# Altium project GNSS_Workshop.PrjPcb
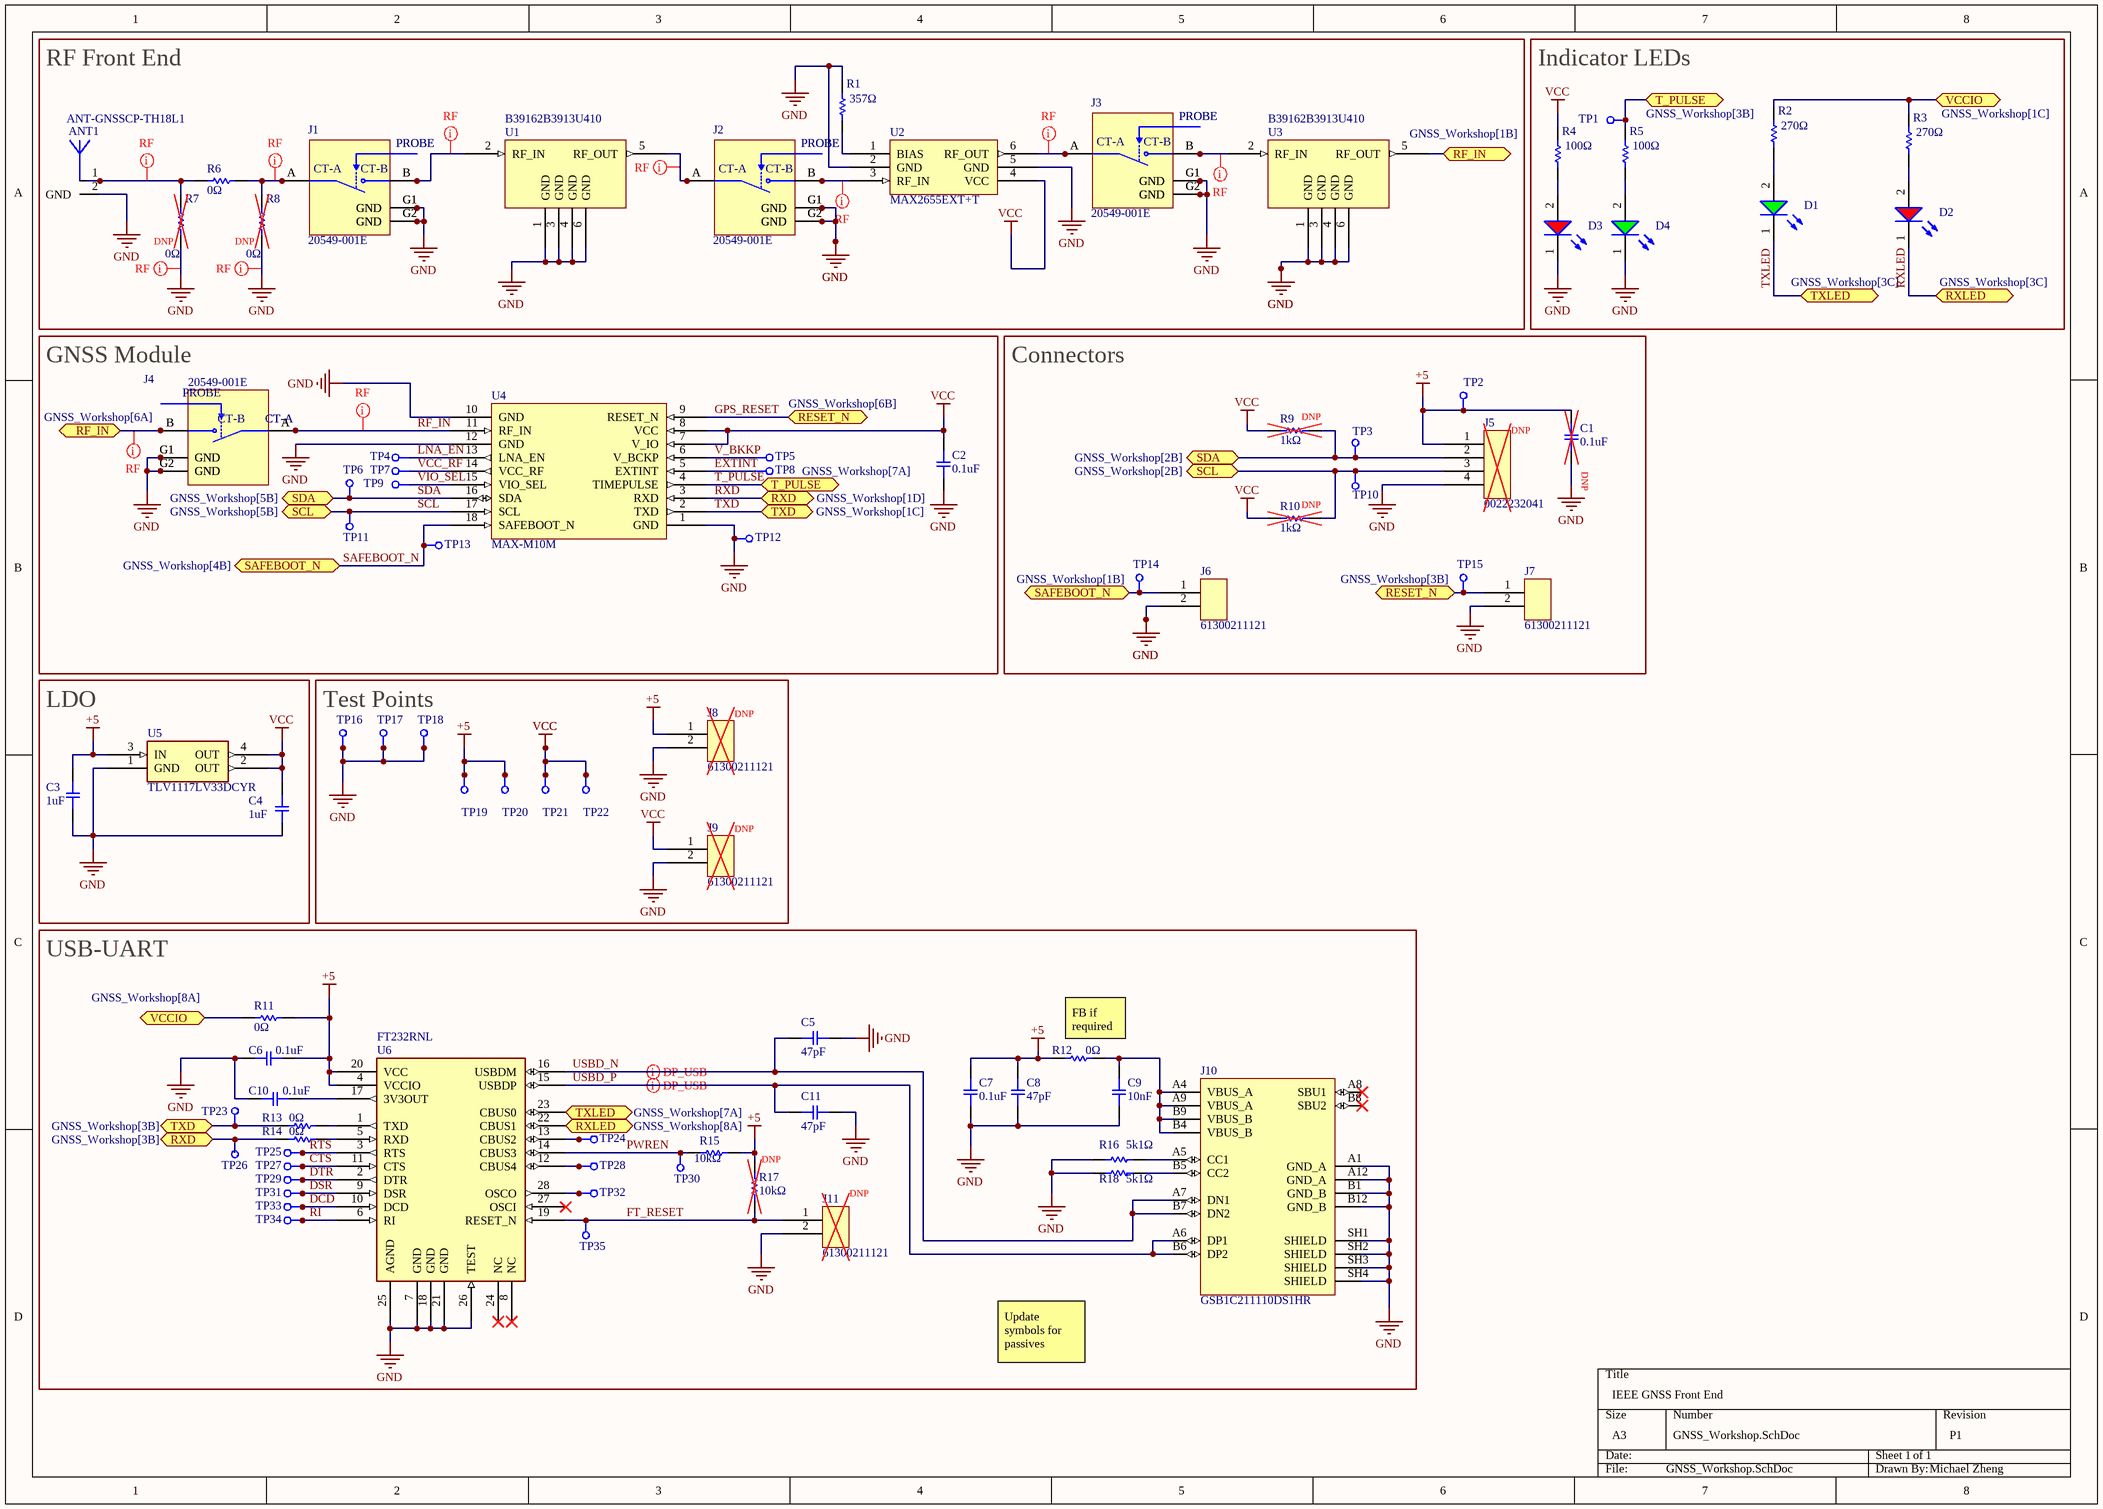
[diagram p0: GNSS_Workshop.SchDoc]
Author: Michael Zheng; Revision: P1; Title: IEEE GNSS Front End
1 sheet, 86 parts. Net scope: flat (ports and power ports of the same name join across sheets).

## Sheet GNSS_Workshop.SchDoc: IEEE GNSS Front End
size A3; SheetNumber: 1; SheetTotal: 1

### Parts
ANT1  ANT-GNSSCP-TH18L1  [ANT-GNSSCP-TH18L1]
C1  Capacitance: 0.1uF  [CAP_MURATA_0603]  (hidden comment: GCM188L81H104KA57D)
C2  Capacitance: 0.1uF  [CAP_MURATA_0603]  (hidden comment: GCM188L81H104KA57D)
C3  Capacitance: 1uF  [CAP_MURATA_0603]  (hidden comment: GRM188R61A105KA61D)
C4  Capacitance: 1uF  [CAP_MURATA_0603]  (hidden comment: GRM188R61A105KA61D)
C5  Capacitance: 47pF  [CAP_MURATA_0603]  (hidden comment: GCM188L81H104KA57D)
C6  Capacitance: 0.1uF  [CAP_MURATA_0603]  (hidden comment: GCM188L81H104KA57D)
C7  Capacitance: 0.1uF  [CAP_MURATA_0603]  (hidden comment: GCM188L81H104KA57D)
C8  Capacitance: 47pF  [CAP_MURATA_0603]  (hidden comment: GCM188L81H104KA57D)
C9  Capacitance: 10nF  [CAP_MURATA_0603]  (hidden comment: GCM188L81H104KA57D)
C10  Capacitance: 0.1uF  [CAP_MURATA_0603]  (hidden comment: GCM188L81H104KA57D)
C11  Capacitance: 47pF  [CAP_MURATA_0603]  (hidden comment: GCM188L81H104KA57D)
D1  Green, 3.2V, 140°  [WL-SMCW - duplicate]  (value not drawn)
D2  Red, 2V, 140°  [WL-SMCW - duplicate]  (value not drawn)
D3  Red, 2V, 140°  [WL-SMCW - duplicate]  (value not drawn)
D4  Green, 3.2V, 140°  [WL-SMCW - duplicate]  (value not drawn)
J1  20549-001E  [IPEX_20549-001E]
J2  20549-001E  [IPEX_20549-001E]
J3  20549-001E  [IPEX_20549-001E]
J4  20549-001E  [IPEX_20549-001E]
J5  0022232041  [CONN HEADER VERT 4POS 2.54MM]
J6  61300211121  [61300211121]
J7  61300211121  [61300211121]
J8  61300211121  [61300211121]
J9  61300211121  [61300211121]
J10  GSB1C211110DS1HR  [AMPHENOL_GSB1C211110DS1HR]
J11  61300211121  [61300211121]
R1  Resistance: 357Ω  [RC0603JR-070RL]  (hidden comment: RC0603JR-070RL)
R2  Resistance: 270Ω  [RC0603JR-070RL]  (hidden comment: RC0603JR-070RL)
R3  Resistance: 270Ω  [RC0603JR-070RL]  (hidden comment: RC0603JR-070RL)
R4  Resistance: 100Ω  [RC0603JR-070RL]  (hidden comment: RC0603JR-070RL)
R5  Resistance: 100Ω  [RC0603JR-070RL]  (hidden comment: RC0603JR-070RL)
R6  Resistance: 0Ω  [RC0603JR-070RL]  (hidden comment: RC0603JR-070RL)
R7  Resistance: 0Ω  [RC0603JR-070RL]  (hidden comment: RC0603JR-070RL)
R8  Resistance: 0Ω  [RC0603JR-070RL]  (hidden comment: RC0603JR-070RL)
R9  Resistance: 1kΩ  [RC0603JR-070RL]  (hidden comment: RC0603JR-070RL)
R10  Resistance: 1kΩ  [RC0603JR-070RL]  (hidden comment: RC0603JR-070RL)
R11  Resistance: 0Ω  [RC0603JR-070RL]  (hidden comment: RC0603JR-070RL)
R12  Resistance: 0Ω  [RC0603JR-070RL]  (hidden comment: RC0603JR-070RL)
R13  Resistance: 0Ω  [RC0603JR-070RL]  (hidden comment: RC0603JR-070RL)
R14  Resistance: 0Ω  [RC0603JR-070RL]  (hidden comment: RC0603JR-070RL)
R15  Resistance: 10kΩ  [RC0603JR-070RL]  (hidden comment: RC0603JR-070RL)
R16  Resistance: 5k1Ω  [RC0603JR-070RL]  (hidden comment: RC0603JR-070RL)
R17  Resistance: 10kΩ  [RC0603JR-070RL]  (hidden comment: RC0603JR-070RL)
R18  Resistance: 5k1Ω  [RC0603JR-070RL]  (hidden comment: RC0603JR-070RL)
TP1  TEST_POINT  [TEST_POINT]  (value not drawn)
TP2  TEST_POINT  [TEST_POINT]  (value not drawn)
TP3  TEST_POINT  [TEST_POINT]  (value not drawn)
TP4  TEST_POINT  [TEST_POINT]  (value not drawn)
TP5  TEST_POINT  [TEST_POINT]  (value not drawn)
TP6  TEST_POINT  [TEST_POINT]  (value not drawn)
TP7  TEST_POINT  [TEST_POINT]  (value not drawn)
TP8  TEST_POINT  [TEST_POINT]  (value not drawn)
TP9  TEST_POINT  [TEST_POINT]  (value not drawn)
TP10  TEST_POINT  [TEST_POINT]  (value not drawn)
TP11  TEST_POINT  [TEST_POINT]  (value not drawn)
TP12  TEST_POINT  [TEST_POINT]  (value not drawn)
TP13  TEST_POINT  [TEST_POINT]  (value not drawn)
TP14  TEST_POINT  [TEST_POINT]  (value not drawn)
TP15  TEST_POINT  [TEST_POINT]  (value not drawn)
TP16  TEST_POINT  [TEST_POINT]  (value not drawn)
TP17  TEST_POINT  [TEST_POINT]  (value not drawn)
TP18  TEST_POINT  [TEST_POINT]  (value not drawn)
TP19  TEST_POINT  [TEST_POINT]  (value not drawn)
TP20  TEST_POINT  [TEST_POINT]  (value not drawn)
TP21  TEST_POINT  [TEST_POINT]  (value not drawn)
TP22  TEST_POINT  [TEST_POINT]  (value not drawn)
TP23  TEST_POINT  [TEST_POINT]  (value not drawn)
TP24  TEST_POINT  [TEST_POINT]  (value not drawn)
TP25  TEST_POINT  [TEST_POINT]  (value not drawn)
TP26  TEST_POINT  [TEST_POINT]  (value not drawn)
TP27  TEST_POINT  [TEST_POINT]  (value not drawn)
TP28  TEST_POINT  [TEST_POINT]  (value not drawn)
TP29  TEST_POINT  [TEST_POINT]  (value not drawn)
TP30  TEST_POINT  [TEST_POINT]  (value not drawn)
TP31  TEST_POINT  [TEST_POINT]  (value not drawn)
TP32  TEST_POINT  [TEST_POINT]  (value not drawn)
TP33  TEST_POINT  [TEST_POINT]  (value not drawn)
TP34  TEST_POINT  [TEST_POINT]  (value not drawn)
TP35  TEST_POINT  [TEST_POINT]  (value not drawn)
U1  B39162B3913U410  [B39162B3913U410]
U2  MAX2655EXT+T  [MAX2655EXT+T]
U3  B39162B3913U410  [B39162B3913U410]
U4  MAX-M10M  [MAX-M10M]
U5  TLV1117LV33DCYR  [TLV1117LV33DCYR]
U6  FT232RNL  [FT232RNL]

### Blocks framed on the sheet
RF Front End: ANT1 J1-J3 R1 R6-R8 U1-U3
Indicator LEDs: D1-D4 R2-R5 TP1
GNSS Module: C2 J4 TP4-TP9 TP11-TP13 U4
Connectors: C1 J5-J7 R9 R10 TP2 TP3 TP10 TP14 TP15
LDO: C3 C4 U5
Test Points: J8 J9 TP16-TP22
USB-UART: C5-C11 J10 J11 R11-R18 TP23-TP35 U6

### Ports
RESET_N (bidir, see GNSS_Workshop[3B]), RESET_N (bidir, see GNSS_Workshop[6B]), RF_IN (bidir, see GNSS_Workshop[1B]), RF_IN (bidir, see GNSS_Workshop[6A]), RXD (bidir, see GNSS_Workshop[1D]), RXD (bidir, see GNSS_Workshop[3B]), RXLED (bidir, see GNSS_Workshop[3C]), RXLED (bidir, see GNSS_Workshop[8A]), SAFEBOOT_N (bidir, see GNSS_Workshop[1B]), SAFEBOOT_N (bidir, see GNSS_Workshop[4B]), SCL (bidir, see GNSS_Workshop[2B]), SCL (bidir, see GNSS_Workshop[5B]), SDA (bidir, see GNSS_Workshop[2B]), SDA (bidir, see GNSS_Workshop[5B]), T_PULSE (bidir, see GNSS_Workshop[3B]), T_PULSE (bidir, see GNSS_Workshop[7A]), TXD (bidir, see GNSS_Workshop[1C]), TXD (bidir, see GNSS_Workshop[3B]), TXLED (bidir, see GNSS_Workshop[3C]), TXLED (bidir, see GNSS_Workshop[7A]), VCCIO (bidir, see GNSS_Workshop[1C]), VCCIO (bidir, see GNSS_Workshop[8A])

### Nets
+5: C1.1 C3.2 C6.2 C7.1 C8.1 J5.1 J8.1 R11.1 R12.1 R15.2 R17.2 TP2.1 TP19.1 TP20.1 U5.3(IN) U6.4(VCCIO) U6.20(VCC)
GND: ANT1.2(GND) C1.2 C2.1 C3.1 C4.1 C5.2 C6.1 C7.2 C8.2 C9.2 C10.2 C11.2 D3.1(K) D4.1(K) J1.G1(GND) J1.G2(GND) J2.G1(GND) J2.G2(GND) J3.G1(GND) J3.G2(GND) J4.G1(GND) J4.G2(GND) J5.4 J6.2 J7.2 J8.2 J9.2 J10.A1(GND_A) J10.A12(GND_A) J10.B1(GND_B) J10.B12(GND_B) J10.SH1(SHIELD) J10.SH2(SHIELD) J10.SH3(SHIELD) J10.SH4(SHIELD) J11.2 R1.2 R7.1 R8.1 R16.1 R18.1 TP12.1 TP16.1 TP17.1 TP18.1 U1.1(GND) U1.3(GND) U1.4(GND) U1.6(GND) U2.2(GND) U2.5(GND) U3.1(GND) U3.3(GND) U3.4(GND) U3.6(GND) U4.1(GND) U4.10(GND) U4.12(GND) U5.1(GND) U6.7(GND) U6.18(GND) U6.21(GND) U6.25(AGND) U6.26(TEST)
VCC: C2.2 C4.2 J9.1 R4.2 R9.2 R10.2 TP21.1 TP22.1 U2.4(VCC) U4.7(V_IO) U4.8(VCC) U5.2(OUT) U5.4(OUT)
CTS: TP27.1 U6.11(CTS)
DCD: TP33.1 U6.10(DCD)
DSR: TP31.1 U6.9(DSR)
DTR: TP29.1 U6.2(DTR)
EXTINT: TP8.1 U4.5(EXTINT)
FT_RESET: J11.1 R17.1 TP35.1 U6.19(RESET_N)
GPS_RESET: J7.1 TP15.1 U4.9(RESET_N) ; port RESET_N
LNA_EN: TP4.1 U4.13(LNA_EN)
PWREN: R15.1 TP30.1 U6.14(CBUS3)
RF_IN: J4.A(CT-A) U4.11(RF_IN)
RI: TP34.1 U6.6(RI)
RTS: TP25.1 U6.3(RTS)
RXD: R14.1 TP26.1 U4.3(RXD) ; port RXD
RXLED: D2.1(K) U6.22(CBUS1) ; port RXLED
SAFEBOOT_N: J6.1 TP13.1 TP14.1 U4.18(SAFEBOOT_N) ; port SAFEBOOT_N
SCL: J5.3 R10.1 TP10.1 TP11.1 U4.17(SCL) ; port SCL
SDA: J5.2 R9.1 TP3.1 TP6.1 U4.16(SDA) ; port SDA
T_PULSE: R5.2 TP1.1 U4.4(TIMEPULSE) ; port T_PULSE
TXD: R13.1 TP23.1 U4.2(TXD) ; port TXD
TXLED: D1.1(K) U6.23(CBUS0) ; port TXLED
USBD_N: C5.1 J10.A7(DN1) J10.B7(DN2) U6.16(USBDM)
USBD_P: C11.1 J10.A6(DP1) J10.B6(DP2) U6.15(USBDP)
V_BKKP: TP5.1 U4.6(V_BCKP)
VCC_RF: TP7.1 U4.14(VCC_RF)
VIO_SEL: TP9.1 U4.15(VIO_SEL)
NetANT1_1: ANT1.1(RF_IN) R6.2 R7.2
NetC9_1: C9.1 J10.A4(VBUS_A) J10.A9(VBUS_A) J10.B4(VBUS_B) J10.B9(VBUS_B) R12.2
NetC10_1: C10.1 U6.17(3V3OUT)
NetD1_2: D1.2(A) R2.1
NetD2_2: D2.2(A) R3.1
NetD3_2: D3.2(A) R4.1
NetD4_2: D4.2(A) R5.1
NetJ1_A: J1.A(CT-A) R6.1 R8.2
NetJ1_B: J1.B(CT-B) U1.2(RF_IN)
NetJ2_A: J2.A(CT-A) U1.5(RF_OUT)
NetJ2_B: J2.B(CT-B) U2.3(RF_IN)
NetJ3_A: J3.A(CT-A) U2.6(RF_OUT)
NetJ3_B: J3.B(CT-B) U3.2(RF_IN)
NetJ4_B: J4.B(CT-B) U3.5(RF_OUT) ; port RF_IN
NetJ10_A5: J10.A5(CC1) R16.2
NetJ10_B5: J10.B5(CC2) R18.2
NetR1_1: R1.1 U2.1(BIAS)
NetR2_2: R2.2 R3.2 R11.2 ; port VCCIO
NetR13_2: R13.2 U6.1(TXD)
NetR14_2: R14.2 U6.5(RXD)
NetTP24_1: TP24.1 U6.13(CBUS2)
NetTP28_1: TP28.1 U6.12(CBUS4)
NetTP32_1: TP32.1 U6.28(OSCO)

Not connected (* = marked no-connect by the designer): J10 A8(SBU1)* B8(SBU2)*; U6 8(NC)* 24(NC)* 27(OSCI)*

### Layout directives
net class RF: GND, NetANT1_1, NetJ1_A, NetJ1_B, NetJ2_A, NetJ2_B, NetJ3_A, NetJ3_B, NetJ4_B, RF_IN
differential pair; differential pair class USB: USBD_N, USBD_P

### Notes on the sheet
- (near R7) DNP
- (near R8) DNP
- (near R9) DNP
- (near J5) DNP
- (near R10) DNP
- (near C1) DNP
- (near J8) DNP
- (near J9) DNP
- (near R12) FB if required
- (near R17) DNP
- (near J11) DNP
- Update symbols for passives
- (in symbol 20549-001E) PROBE

### Library data of the parts
ANT1 = ANT-GNSSCP-TH18L1: CERAMIC PATCH GNSS ANTENNA
C1 C2 C5-C11 = GCM188L81H104KA57D: CAP CER 0.1UF 50V X8L 0603
C3 C4 = GRM188R61A105KA61D: CAP CER 1UF 10V X5R 0603
D1 D4 = 150060GS75000: WL-SMCW Mono-color Chip LED Waterclear, SMT, size 0603, Green, 3.2V, 140°; Manufacturer: Wurth Elektronik; Case/Size Code: 0603; Chip Technology: InGaN; Dominant Wavelength: 525nm; Luminous Intensity: 430mcd; Peak Wavelength: 515nm; Manufacturer Part Number: 150060GS75000; Category: Signal LEDs; Match Code: WL-SMCW; ComponentLink1Description: Website Link; ComponentLink1URL: https://www.we-online.com/redexpert/article/150060GS75000?ad; ComponentLink2Description: Datasheet Link; ComponentLink2URL: https://www.we-online.com/redexpert/spec/150060GS75000?ad; Mount: Surface Mount; Operating Temperature Max: 85°C; Operating Temperature Min: -40°C; Packaging: Tape and Reel; Length: 1.6mm; Width: 0.8mm; Height: 0.7mm; Emitting Color: Green; Forward Voltage: 3.2V; Viewing Angle: 140°
D2 D3 = 150060RS75000: WL-SMCW Mono-color Chip LED Waterclear, SMT, size 0603, Red, 2V, 140°; Manufacturer: Wurth Elektronik; Case/Size Code: 0603; Chip Technology: AlInGaP; Dominant Wavelength: 625nm; Luminous Intensity: 250mcd; Peak Wavelength: 630nm; Manufacturer Part Number: 150060RS75000; Category: Signal LEDs; Match Code: WL-SMCW; ComponentLink1Description: Website Link; ComponentLink1URL: https://www.we-online.com/redexpert/article/150060RS75000?ad; ComponentLink2Description: Datasheet Link; ComponentLink2URL: https://www.we-online.com/redexpert/spec/150060RS75000?ad; Mount: Surface Mount; Operating Temperature Max: 85°C; Operating Temperature Min: -40°C; Packaging: Tape and Reel; Length: 1.6mm; Width: 0.8mm; Height: 0.7mm; Emitting Color: Red; Forward Voltage: 2V; Viewing Angle: 140°
J1-J4 = 20549-001E: 1 POS Vertical SMD Coaxial RF switch connector with a 2.3 x 2.3 mm footprint and support to 11 GHz, MHC; MF: I-PEX; Package: None; Value: *; MP: 20549-001E; Availability: Warning; Price: None; SnapEDA_Link: https://www.snapeda.com/parts/20549-001E/I-PEX/view-part/3220455/?ref=snap; Check_prices: https://www.snapeda.com/parts/20549-001E/I-PEX/view-part/3220455/?ref=eda
J5 = 0022232041: CONN HEADER VERT 4POS 2.54MM
J6-J9 J11 = 61300211121: CONN HEADER VERT 2POS 2.54MM
J10 = GSB1C211110DS1HR: USB2.0, Type C, Top mount, Center Height 1.78mm, Dual Row DIP; MF: Amphenol Canada; SnapEDA_Link: https://www.snapeda.com/parts/GSB1C211110DS1HR/Amphenol/view-part/?ref=snap; Package: None; Value: *; MP: GSB1C211110DS1HR; Check_prices: https://www.snapeda.com/parts/GSB1C211110DS1HR/Amphenol/view-part/?ref=eda
R1-R18 = RC0603JR-070RL: Chip Resistor, 0 Ohm, +/- 5%, 0.1 W, -55 to 155 degC, 0603 (1608 Metric), RoHS, Tape and Reel; Manufacturer: Yageo; Temperature Coefficient: 200ppm/degreesC; Voltage Rating: 50V; Power Rating: 100mW; Width: 0.8mm; Max Operating Temperature: 155degC; Tolerance: 5%; Package Reference: 0603; Height: 0.45mm; Depth: 0.8mm; Package Description: 2-Pin Surface Mount Device, Body 1.6 x 0.8 mm; Termination: SMD/SMT; Package Quantity: 5000; Case/Package: 0603; Case Code (Imperial): 0603; Radiation Hardening: No; Number of Pins: 2; Length: 1.6mm; Lead Free: LeadFree; Voltage Rating (DC): 50V; Military Standard: Not; Datasheet URL: http://www.yageo.com/NewPortal/yageodocoutput?fileName=/pdf/R-Chip/PYu-RC_Group_51_RoHS_L_5.pdf; Manufacturer URL: http://www.yageo.com/; Packaging: TapeandReel; Case Code (Metric): 1608; Min Operating Temperature: -55degC; Composition: ThickFilm; RoHSCompliant: true; Contact Plating: Tin; Datasheet Version: Rev. 5, 10/2016; REACH SVHC: NoSVHC
TP1-TP35 = TEST_POINT: TEST POINT 2MM
U1 U3 = B39162B3913U410: FILTER SAW 1.588GHZ 6SMD
U2 = MAX2655EXT+T: IC AMP GPS 1.4GHZ-1.7GHZ SC70-6
U4 = MAX-M10M: GNSS LCC RX MOD, ROM, CRYSTAL
U5 = TLV1117LV33DCYR: IC REG LINEAR 3.3V 1A SOT223-4
U6 = FT232RNL: USB FULL SPEED TO SERIAL UART IC

## Assembly variants
Variant of GNSS_Workshop: not fitted C1 J5 J8 J9 J11 R7 R8 R9 R10 R17